# Altium schematic sheet POWER.SchDoc
size A4; SheetNumber: 4; SheetTotal: 7
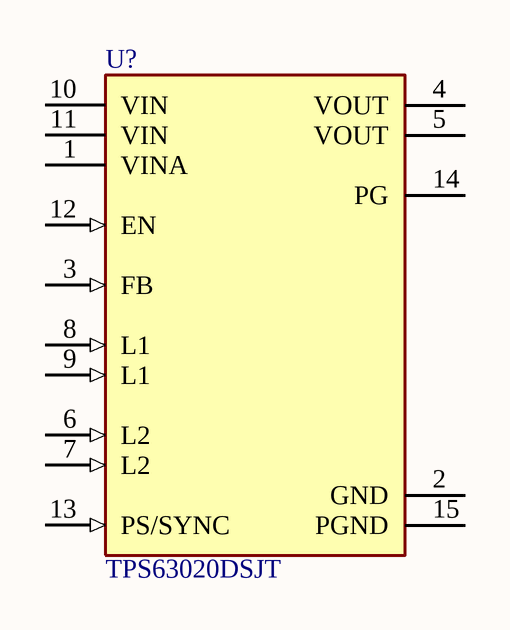
[diagram p0: POWER.SchDoc]

## Parts
U?  TPS63020DSJT  [FP-DSJ0014A-MFG]

## Nets

Not connected (* = marked no-connect by the designer): U? 1(VINA) 2(GND) 3(FB) 4(VOUT) 5(VOUT) 6(L2) 7(L2) 8(L1) 9(L1) 10(VIN) 11(VIN) 12(EN) 13(PS/SYNC) 14(PG) 15(PGND)

## Library data of the parts
U? = CMP-2000-07282-2: IC REG BCK BST ADJ 3.5A 14VSON; Manufacturer: Texas Instruments; Switching Frequency: 2400kHz; Output Voltage: 1.2-5.5V; Nominal Supply Current: 25uA; Standoff Height: 0mm; Switching Topology: Buck-Boost; Min Supply Voltage: 1.8V; Description: IC REG BUCK BST ADJ 3.5A 14VSON; Output Type: AdjustableProgrammable; Max Junction Temp: +125°C; Number Of Outputs: 1; Output Current: 3A; Max Supply Voltage: 5.5V; ComponentLink2URL: https://www.ti.com/lit/ds/symlink/tps63020.pdf; Ambient Temperature Range High: +85°C; Digikey Description: IC REG BCK BST ADJ 3.5A 14VSON; Ambient Temperature Range Low: -40°C; Manufacturer Part Number: TPS63020DSJT; Automotive: No; Package: DSJ0014A; Category: IC; Temperature Range High: +85°C; Temperature: -40°C to +85°C; Octopart: https://octopart.com/tps63020dsjt-texas+instruments-12976119; Temperature Range Low: -40°C; Device Class L3: Voltage Regulators - Switching; Device Class L2: Power Management ICs; RoHS: TRUE; Lead Free: Yes; Height: 1mm; Device Class L1: Integrated Circuits (ICs); Mouser Description: Voltage Regulators - Switching Regulators 93% Eff Buck-Boost Converter; ComponentLink2Description: Datasheet